# Altium schematic sheet Power.SchDoc
size A4
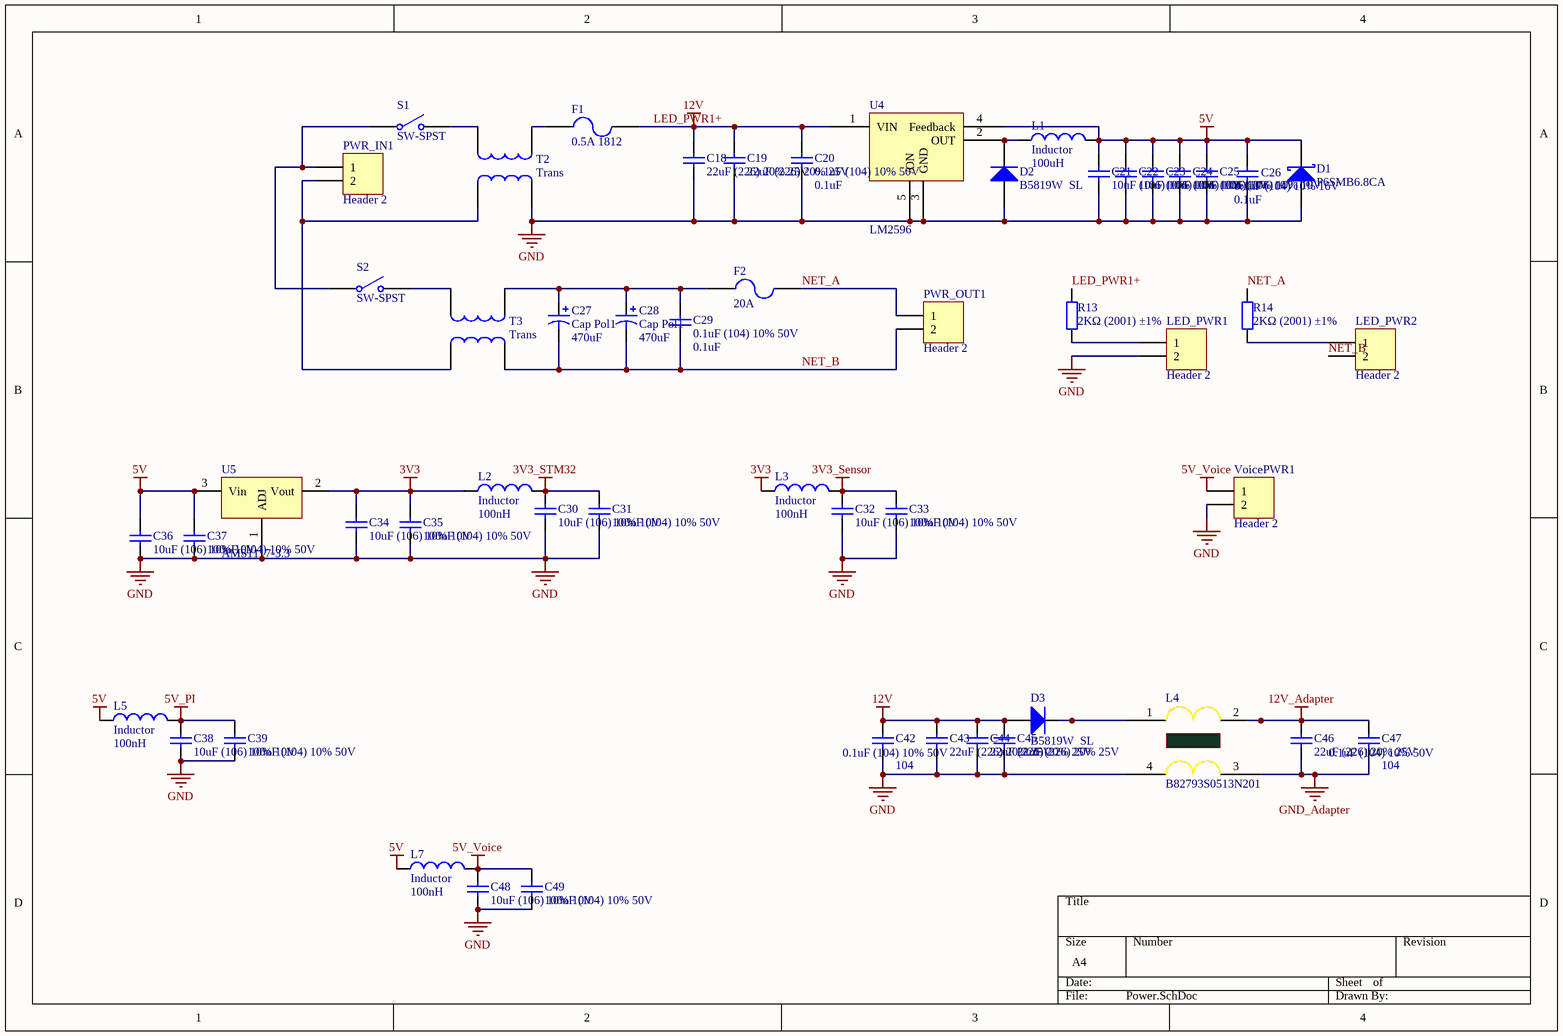
[diagram p0: Power.SchDoc]

## Parts
C18  22uF (226) 20% 25V  [0805_C]
C19  22uF (226) 20% 25V  [0805_C]
C20  0.1uF (104) 10% 50V  value 0.1uF  [0805_C]
C21  10uF (106) 10% 10V  [0603_C]
C22  10uF (106) 10% 10V  [0603_C]
C23  10uF (106) 10% 10V  [0603_C]
C24  10uF (106) 10% 10V  [0603_C]
C25  10uF (106) 10% 10V  [0603_C]
C26  0.1uF (104) 10% 16V  value 0.1uF  [0603_C]
C27  Cap Pol1  value 470uF  [RB5-10.5]
C28  Cap Pol1  value 470uF  [RB5-10.5]
C29  0.1uF (104) 10% 50V  value 0.1uF  [0805_C]
C30  10uF (106) 10% 10V  [0603_C]
C31  100nF (104) 10% 50V  [0603_C]
C32  10uF (106) 10% 10V  [0603_C]
C33  100nF (104) 10% 50V  [0603_C]
C34  10uF (106) 10% 10V  [0603_C]
C35  100nF (104) 10% 50V  [0603_C]
C36  10uF (106) 10% 10V  [0603_C]
C37  100nF (104) 10% 50V  [0603_C]
C38  10uF (106) 10% 10V  [0603_C]
C39  100nF (104) 10% 50V  [0603_C]
C42  0.1uF (104) 10% 50V  value 104  [0805_C]
C43  22uF (226) 20% 25V  [0805_C]
C44  22uF (226) 20% 25V  [0805_C]
C45  22uF (226) 20% 25V  [0805_C]
C46  22uF (226) 20% 25V  [0805_C]
C47  0.1uF (104) 10% 50V  value 104  [0805_C]
C48  10uF (106) 10% 10V  [0603_C]
C49  100nF (104) 10% 50V  [0603_C]
D1  P6SMB6.8CA  [SMB(DO-214AA)_S1]
D2  B5819W  SL  [SOD-123]
D3  B5819W  SL  [SOD-123]
F1  0.5A 1812  [1812]
F2  20A  [Fuse_Small]
L1  Inductor  value 100uH  [L1050(10x10x4)]
L2  Inductor  value 100nH  [0603_L]
L3  Inductor  value 100nH  [0603_L]
L4  B82793S0513N201  [B82793S0513N201_Yes]
L5  Inductor  value 100nH  [0603_L]
L7  Inductor  value 100nH  [0603_L]
LED_PWR1  Header 2  [XH2.54_2P]
LED_PWR2  Header 2  [XH2.54_2P]
PWR_IN1  Header 2  [T型口]
PWR_OUT1  Header 2  [T型口]
R13  2KΩ (2001) ±1%  [LC-0603_R]
R14  2KΩ (2001) ±1%  [LC-0603_R]
S1  SW-SPST  [XH2.54_2P]
S2  SW-SPST  [T型口]
T2  Trans  [UU9.8]
T3  Trans  [20A共模电感]
U4  LM2596  [TO-263-5]
U5  AMS1117-3.3  [SOT-223]
VoicePWR1  Header 2  [XH2.54_2P]

## Nets
3V3: C34.2 C35.2 L2.1 L3.1 U5.2(Vout)
3V3_Sensor: C32.2 C33.2 L3.2
3V3_STM32: C30.2 C31.2 L2.2
5V: C21.2 C22.2 C23.2 C24.2 C25.2 C26.2 C36.2 C37.2 D1.2(K) L1.2 L5.1 L7.1 U4.4(Feedback) U5.3(Vin)
5V_PI: C38.2 C39.2 L5.2
5V_Voice: C48.2 C49.2 L7.2 VoicePWR1.1
12V_Adapter: C46.2 C47.2 L4.2
GND: C18.1 C19.1 C20.1 C21.1 C22.1 C23.1 C24.1 C25.1 C26.1 C30.1 C31.1 C32.1 C33.1 C34.1 C35.1 C36.1 C37.1 C38.1 C39.1 C42.1 C43.1 C44.1 C45.1 C48.1 C49.1 D1.1(A) D2.1(A) L4.4 LED_PWR1.2 T2.2 U4.3(GND) U4.5(/ON) U5.1(ADJ) VoicePWR1.2
GND_Adapter: C46.1 C47.1 L4.3
LED_PWR1+: C18.2 C19.2 C20.2 C42.2 C43.2 C44.2 C45.2 D3.1(A) F1.2 R13.1 U4.1(VIN)  [also labelled 12V]
NET_A: F2.2 PWR_OUT1.1 R14.1
NET_B: C27.2 C28.2 C29.1 LED_PWR2.2 PWR_OUT1.2 T3.2
NetC27_1: C27.1 C28.1 C29.2 F2.1 T3.4
NetD2_2: D2.2(K) L1.1 U4.2(OUT)
NetD3_2: D3.2(K) L4.1
NetF1_1: F1.1 T2.4
NetLED_PWR1_1: LED_PWR1.1 R13.2
NetLED_PWR2_1: LED_PWR2.1 R14.2
NetPWR_IN1_1: PWR_IN1.1 S1.1(COMMON) S2.1(COMMON)
NetPWR_IN1_2: PWR_IN1.2 T2.1 T3.1
NetS1_2: S1.2(NO) T2.3
NetS2_2: S2.2(NO) T3.3

## Library data of the parts
C18 C19 C43-C46 = 0805 22uF (226) 20% 25V: 贴片电容; ComponentLink1Description: 供应商链接; ComponentLink1URL: http://www.szlcsc.com/product/details_46786.html; Package: 0805; Supplier: LC; SuppliersPartNumber: C45783
C20 C26 C29 C42 C47 = Cap: Capacitor; Published: 8-Jun-2000; LatestRevisionDate: 17-Jul-2002; LatestRevisionNote: Re-released for DXP Platform.; PackageReference: RAD-0.3; Publisher: Altium Limited; PackageDescription: Radial Cap, Thru-Hole; 2 Leads; 0.3 in Pin Spacing
C21-C25 C30 C32 C34 C36 C38 C48 = 0603 10uF (106) 10% 10V: 贴片电容; ComponentLink1Description: 供应商链接; ComponentLink1URL: http://www.szlcsc.com/product/details_20411.html; Package: 0603; Supplier: LC; SuppliersPartNumber: C19702
C27 C28 = Cap Pol1: Polarized Capacitor (Radial); Published: 8-Jun-2000; LatestRevisionDate: 17-Jul-2002; LatestRevisionNote: Re-released for DXP Platform.; PackageReference: RB7.6-15; Publisher: Altium Limited; PackageDescription: Polarized Capacitor (Radial); 2 Leads
C31 C33 C35 C37 C39 C49 = 0603 100nF (104) 10% 50V: 贴片电容; ComponentLink1Description: 供应商链接; ComponentLink1URL: http://www.szlcsc.com/product/details_15331.html; Package: 0603; Supplier: LC; SuppliersPartNumber: C14663
D1 = D Schottky: Schottky Diode; Published: 8-Jun-2000; LatestRevisionDate: 17-Jul-2002; LatestRevisionNote: Re-released for DXP Platform.; PackageReference: SMB; Publisher: Altium Limited; PackageDescription: DO-214-AA/SMB; 2 C-Bend Leads; Body 5.3 x 3.6 mm, inc. leads (LxW); Code_JEDEC: DO-214-AA
D2 D3 = SOD-123 B5819W  SL: 肖特基二极管; ComponentLink1Description: 供应商链接; ComponentLink1URL: http://www.szlcsc.com/product/details_9093.html; Package: SOD-123; Supplier: LC; SuppliersPartNumber: C8598
F1 F2 = Fuse 2: Fuse; Published: 8-Jun-2000; LatestRevisionDate: 17-Jul-2002; LatestRevisionNote: Re-released for DXP Platform.; PackageReference: PIN-W2/E2.8; Publisher: Altium Limited; PackageDescription: Thru-Hole; 2 Leads
L1-L3 L5 L7 = Inductor: Code_IEC: 1005; Published: 8-Jun-2000; LatestRevisionDate: 29-May-2009; LatestRevisionNote: IPC-7351 Footprint Added.; PackageReference: 0402-A; Publisher: Altium Limited; PackageDescription: Chip Inductor; Code_JEITA: 0402
LED_PWR1 LED_PWR2 PWR_IN1 PWR_OUT1 VoicePWR1 = Header 2: Header, 2-Pin; LatestRevisionDate: 17-Jul-2002; LatestRevisionNote: Re-released for DXP Platform.; Publisher: Altium Limited
R13 R14 = 0603 2KΩ (2001) 1%: 贴片电阻; ComponentLink1Description: 供应商链接; ComponentLink1URL: http://www.szlcsc.com/product/details_23702.html; Package: 0603; Supplier: LC; SuppliersPartNumber: C22975
S1 S2 = SW-SPST: Single-Pole, Single-Throw Switch; Published: 24-Mar-1999; LatestRevisionDate: 17-Jul-2002; LatestRevisionNote: Re-released for DXP Platform.; PackageReference: SPST-2; Publisher: Altium Limited; PackageDescription: Switch; 2 Leads
T2 T3 = Trans: Transformer; Published: 24-Mar-1999; LatestRevisionDate: 08-Jul-2005; LatestRevisionNote: Mech Layer 1 removed.; PackageReference: TRANS; Publisher: Altium Limited; PackageDescription: Transformer; 4 Leads
U4 = LM2576
U5 = LM317: 3-Terminal Adjustable Positive Voltage Regulator